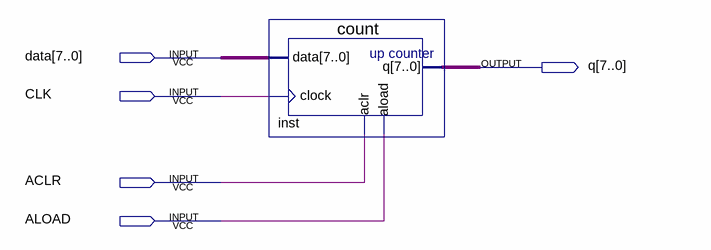
[diagram p0: schematic sheet]
// Quartus schematic count2627.bdf as structural Verilog: 1 symbols, 5 pins
module count2627 (
  input  [7:0] data,
  input  CLK,
  input  ACLR,
  input  ALOAD,
  output [7:0] q
);

  count inst (.data(data), .clock(CLK), .aclr(ACLR), .aload(ALOAD), .q(q));
endmodule
